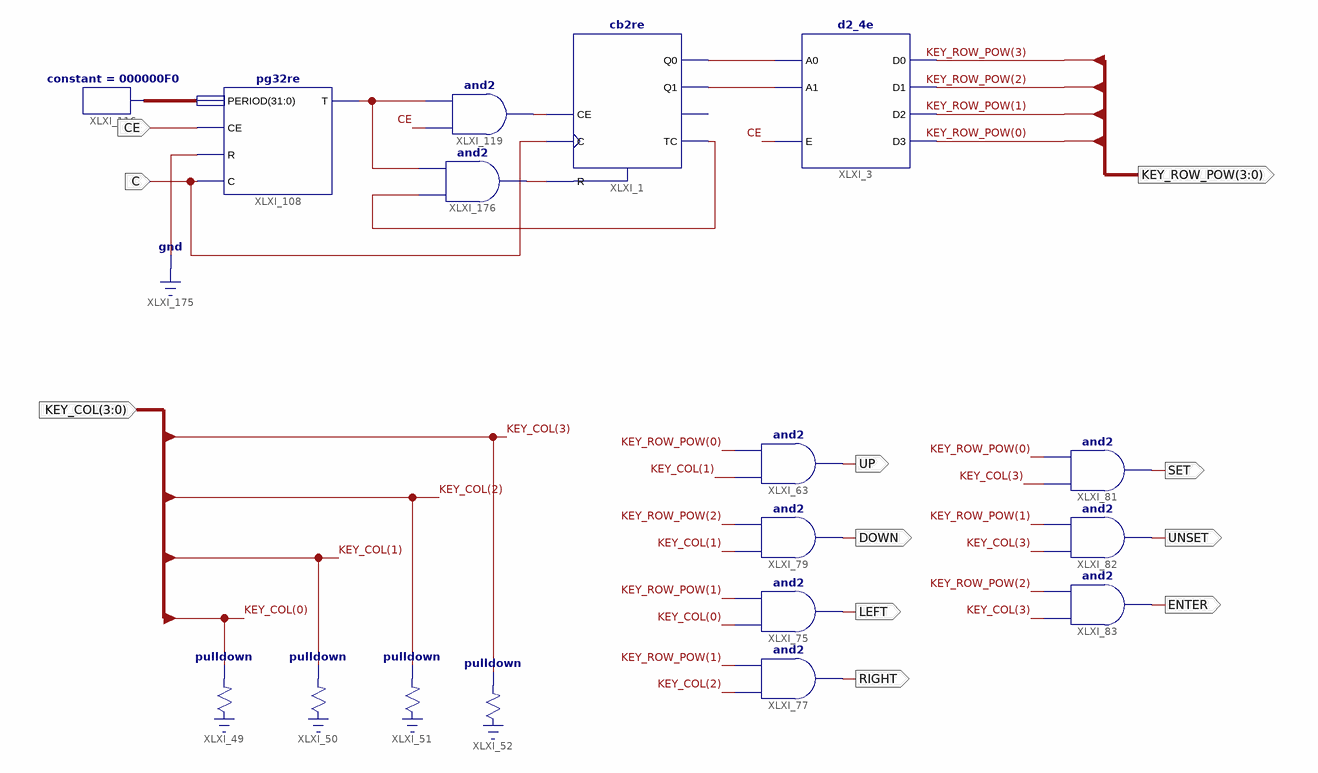
[diagram p0: schematic sheet 1]
// Xilinx ISE schematic input_detect.sch (spartan6) as structural Verilog: 17 symbols, 11 ports
module input_detect (
  input  CE,
  input  C,
  input  [3:0] KEY_COL,
  output [3:0] KEY_ROW_POW,
  output UP,
  output DOWN,
  output LEFT,
  output RIGHT,
  output SET,
  output UNSET,
  output ENTER
);

  wire XLXN_1, XLXN_2, XLXN_323, XLXN_448, XLXN_450, XLXN_451;
  wire [31:0] XLXN_343;

  cb2re XLXI_1 (.C(C), .CE(XLXN_323), .R(XLXN_451), .Q0(XLXN_1), .Q1(XLXN_2), .TC(XLXN_450));  // open: CEO
  and XLXI_176 (XLXN_451, XLXN_450, XLXN_448);
  \pulldown  XLXI_49 (.O(KEY_COL[0]));
  \pulldown  XLXI_50 (.O(KEY_COL[1]));
  \pulldown  XLXI_51 (.O(KEY_COL[2]));
  and XLXI_63 (UP, KEY_COL[1], KEY_ROW_POW[0]);
  and XLXI_79 (DOWN, KEY_COL[1], KEY_ROW_POW[2]);
  and XLXI_75 (LEFT, KEY_COL[0], KEY_ROW_POW[1]);
  and XLXI_77 (RIGHT, KEY_COL[2], KEY_ROW_POW[1]);
  and XLXI_81 (SET, KEY_COL[3], KEY_ROW_POW[0]);
  and XLXI_82 (UNSET, KEY_COL[3], KEY_ROW_POW[1]);
  and XLXI_83 (ENTER, KEY_COL[3], KEY_ROW_POW[2]);
  \pulldown  XLXI_52 (.O(KEY_COL[3]));
  constant #(.CValue("000000F0")) XLXI_116 (.O(XLXN_343));
  pg32re XLXI_108 (.C(C), .CE(CE), .PERIOD(XLXN_343), .R(1'b0), .T(XLXN_448));
  and XLXI_119 (XLXN_323, CE, XLXN_448);
  d2_4e XLXI_3 (
    .A0(XLXN_1), .A1(XLXN_2), .E(CE), .D0(KEY_ROW_POW[3]), .D1(KEY_ROW_POW[2]), .D2(KEY_ROW_POW[1]),
    .D3(KEY_ROW_POW[0]));
endmodule
